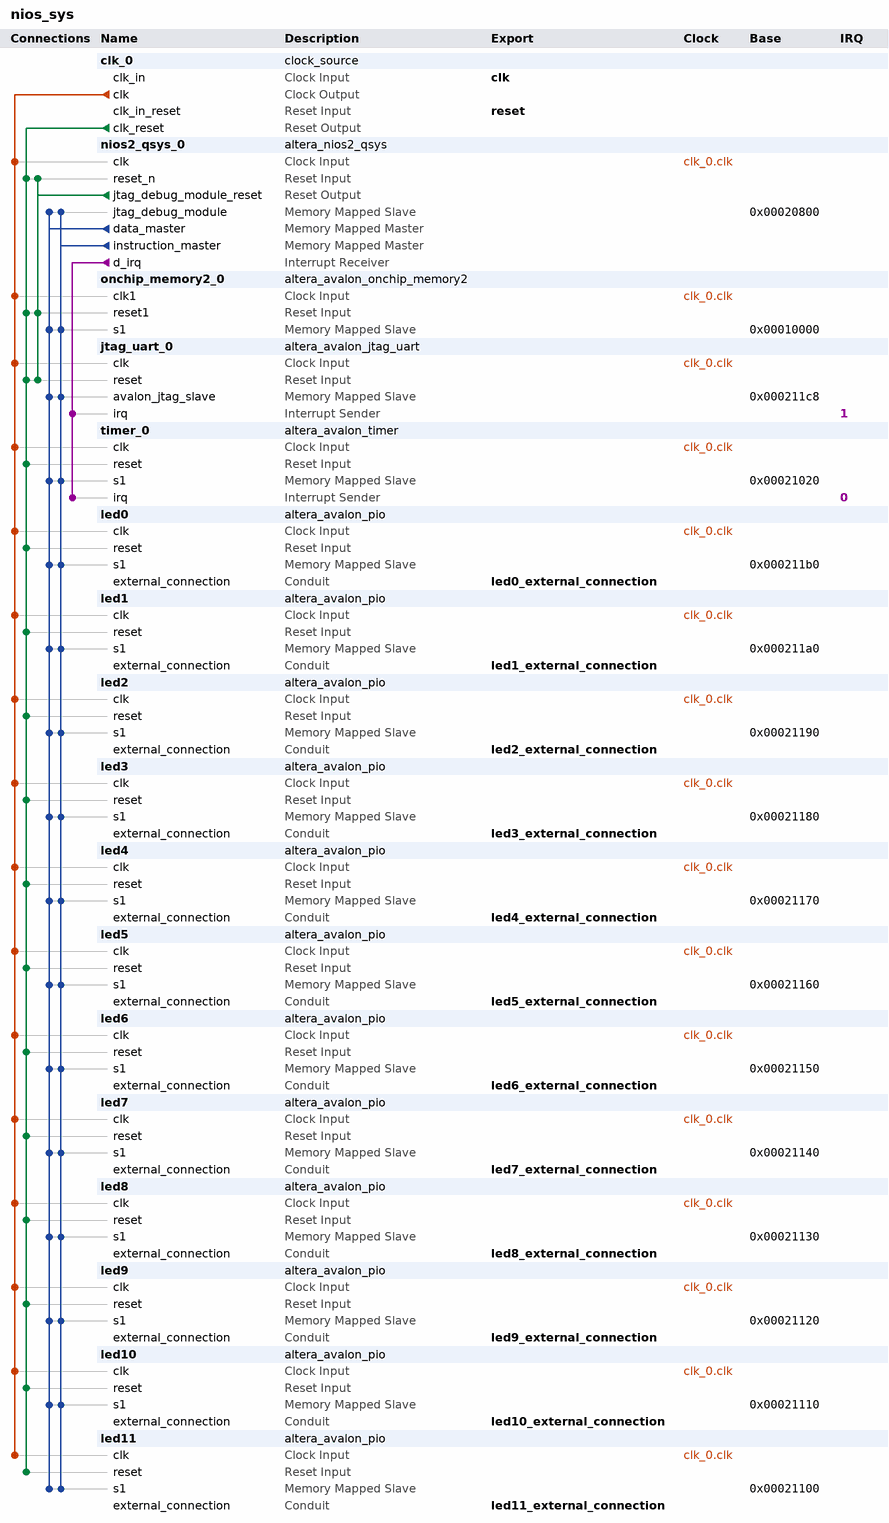
[diagram p0: system contents]
# Platform Designer (Qsys) system nios_sys, Cyclone IV E EP4CE115F29C8
# Parameters at their usual value, and those the tool derives, are not listed.
package require -exact qsys 13.0.1.99.2
create_system nios_sys
set_project_property DEVICE_FAMILY {Cyclone IV E}
set_project_property DEVICE EP4CE115F29C8

add_instance clk_0 clock_source 13.0
set_instance_parameter_value clk_0 clockFrequency 50000000

add_instance nios2_qsys_0 altera_nios2_qsys 13.0
set_instance_parameter_value nios2_qsys_0 resetSlave onchip_memory2_0.s1
set_instance_parameter_value nios2_qsys_0 mmu_TLBMissExcSlave None
set_instance_parameter_value nios2_qsys_0 exceptionSlave onchip_memory2_0.s1
set_instance_parameter_value nios2_qsys_0 breakSlave nios2_qsys_0.jtag_debug_module
set_instance_parameter_value nios2_qsys_0 impl Small
set_instance_parameter_value nios2_qsys_0 icache_size 4096

add_instance onchip_memory2_0 altera_avalon_onchip_memory2 13.0.1.99.2
set_instance_parameter_value onchip_memory2_0 dataWidth 32
set_instance_parameter_value onchip_memory2_0 dualPort false
set_instance_parameter_value onchip_memory2_0 initMemContent true
set_instance_parameter_value onchip_memory2_0 initializationFileName onchip_mem.hex
set_instance_parameter_value onchip_memory2_0 memorySize 40000

add_instance jtag_uart_0 altera_avalon_jtag_uart 13.0.1.99.2
set_instance_parameter_value jtag_uart_0 simInteractiveOptions NO_INTERACTIVE_WINDOWS

add_instance timer_0 altera_avalon_timer 13.0.1.99.2
set_instance_parameter_value timer_0 period 1
set_instance_parameter_value timer_0 periodUnits MSEC

add_instance led0 altera_avalon_pio 13.0.1.99.2
set_instance_parameter_value led0 direction Output
set_instance_parameter_value led0 width 8

add_instance led1 altera_avalon_pio 13.0.1.99.2
set_instance_parameter_value led1 direction Output
set_instance_parameter_value led1 width 8

add_instance led2 altera_avalon_pio 13.0.1.99.2
set_instance_parameter_value led2 direction Output
set_instance_parameter_value led2 width 8

add_instance led3 altera_avalon_pio 13.0.1.99.2
set_instance_parameter_value led3 direction Output
set_instance_parameter_value led3 width 8

add_instance led4 altera_avalon_pio 13.0.1.99.2
set_instance_parameter_value led4 direction Output
set_instance_parameter_value led4 width 8

add_instance led5 altera_avalon_pio 13.0.1.99.2
set_instance_parameter_value led5 direction Output
set_instance_parameter_value led5 width 8

add_instance led6 altera_avalon_pio 13.0.1.99.2
set_instance_parameter_value led6 direction Output
set_instance_parameter_value led6 width 8

add_instance led7 altera_avalon_pio 13.0.1.99.2
set_instance_parameter_value led7 direction Output
set_instance_parameter_value led7 width 8

add_instance led8 altera_avalon_pio 13.0.1.99.2
set_instance_parameter_value led8 direction Output
set_instance_parameter_value led8 width 8

add_instance led9 altera_avalon_pio 13.0.1.99.2
set_instance_parameter_value led9 direction Output
set_instance_parameter_value led9 width 8

add_instance led10 altera_avalon_pio 13.0.1.99.2
set_instance_parameter_value led10 direction Output
set_instance_parameter_value led10 width 8

add_instance led11 altera_avalon_pio 13.0.1.99.2
set_instance_parameter_value led11 direction Output
set_instance_parameter_value led11 width 8

# connections
add_connection clk_0.clk jtag_uart_0.clk clock
add_connection clk_0.clk led0.clk clock
add_connection clk_0.clk led1.clk clock
add_connection clk_0.clk led2.clk clock
add_connection clk_0.clk led3.clk clock
add_connection clk_0.clk led4.clk clock
add_connection clk_0.clk led5.clk clock
add_connection clk_0.clk led6.clk clock
add_connection clk_0.clk led7.clk clock
add_connection clk_0.clk led8.clk clock
add_connection clk_0.clk led9.clk clock
add_connection clk_0.clk led10.clk clock
add_connection clk_0.clk led11.clk clock
add_connection clk_0.clk nios2_qsys_0.clk clock
add_connection clk_0.clk onchip_memory2_0.clk1 clock
add_connection clk_0.clk timer_0.clk clock
add_connection clk_0.clk_reset jtag_uart_0.reset reset
add_connection clk_0.clk_reset led0.reset reset
add_connection clk_0.clk_reset led1.reset reset
add_connection clk_0.clk_reset led2.reset reset
add_connection clk_0.clk_reset led3.reset reset
add_connection clk_0.clk_reset led4.reset reset
add_connection clk_0.clk_reset led5.reset reset
add_connection clk_0.clk_reset led6.reset reset
add_connection clk_0.clk_reset led7.reset reset
add_connection clk_0.clk_reset led8.reset reset
add_connection clk_0.clk_reset led9.reset reset
add_connection clk_0.clk_reset led10.reset reset
add_connection clk_0.clk_reset led11.reset reset
add_connection clk_0.clk_reset nios2_qsys_0.reset_n reset
add_connection clk_0.clk_reset onchip_memory2_0.reset1 reset
add_connection clk_0.clk_reset timer_0.reset reset
add_connection nios2_qsys_0.jtag_debug_module_reset jtag_uart_0.reset reset
add_connection nios2_qsys_0.jtag_debug_module_reset nios2_qsys_0.reset_n reset
add_connection nios2_qsys_0.jtag_debug_module_reset onchip_memory2_0.reset1 reset
add_connection nios2_qsys_0.data_master jtag_uart_0.avalon_jtag_slave avalon
set_connection_parameter_value nios2_qsys_0.data_master/jtag_uart_0.avalon_jtag_slave baseAddress 0x000211c8
add_connection nios2_qsys_0.data_master led0.s1 avalon
set_connection_parameter_value nios2_qsys_0.data_master/led0.s1 baseAddress 0x000211b0
add_connection nios2_qsys_0.data_master led1.s1 avalon
set_connection_parameter_value nios2_qsys_0.data_master/led1.s1 baseAddress 0x000211a0
add_connection nios2_qsys_0.data_master led2.s1 avalon
set_connection_parameter_value nios2_qsys_0.data_master/led2.s1 baseAddress 0x00021190
add_connection nios2_qsys_0.data_master led3.s1 avalon
set_connection_parameter_value nios2_qsys_0.data_master/led3.s1 baseAddress 0x00021180
add_connection nios2_qsys_0.data_master led4.s1 avalon
set_connection_parameter_value nios2_qsys_0.data_master/led4.s1 baseAddress 0x00021170
add_connection nios2_qsys_0.data_master led5.s1 avalon
set_connection_parameter_value nios2_qsys_0.data_master/led5.s1 baseAddress 0x00021160
add_connection nios2_qsys_0.data_master led6.s1 avalon
set_connection_parameter_value nios2_qsys_0.data_master/led6.s1 baseAddress 0x00021150
add_connection nios2_qsys_0.data_master led7.s1 avalon
set_connection_parameter_value nios2_qsys_0.data_master/led7.s1 baseAddress 0x00021140
add_connection nios2_qsys_0.data_master led8.s1 avalon
set_connection_parameter_value nios2_qsys_0.data_master/led8.s1 baseAddress 0x00021130
add_connection nios2_qsys_0.data_master led9.s1 avalon
set_connection_parameter_value nios2_qsys_0.data_master/led9.s1 baseAddress 0x00021120
add_connection nios2_qsys_0.data_master led10.s1 avalon
set_connection_parameter_value nios2_qsys_0.data_master/led10.s1 baseAddress 0x00021110
add_connection nios2_qsys_0.data_master led11.s1 avalon
set_connection_parameter_value nios2_qsys_0.data_master/led11.s1 baseAddress 0x00021100
add_connection nios2_qsys_0.data_master nios2_qsys_0.jtag_debug_module avalon
set_connection_parameter_value nios2_qsys_0.data_master/nios2_qsys_0.jtag_debug_module baseAddress 0x00020800
add_connection nios2_qsys_0.data_master onchip_memory2_0.s1 avalon
set_connection_parameter_value nios2_qsys_0.data_master/onchip_memory2_0.s1 baseAddress 0x00010000
add_connection nios2_qsys_0.data_master timer_0.s1 avalon
set_connection_parameter_value nios2_qsys_0.data_master/timer_0.s1 baseAddress 0x00021020
add_connection nios2_qsys_0.instruction_master jtag_uart_0.avalon_jtag_slave avalon
set_connection_parameter_value nios2_qsys_0.instruction_master/jtag_uart_0.avalon_jtag_slave baseAddress 0x000211c8
add_connection nios2_qsys_0.instruction_master led0.s1 avalon
set_connection_parameter_value nios2_qsys_0.instruction_master/led0.s1 baseAddress 0x000211b0
add_connection nios2_qsys_0.instruction_master led1.s1 avalon
set_connection_parameter_value nios2_qsys_0.instruction_master/led1.s1 baseAddress 0x000211a0
add_connection nios2_qsys_0.instruction_master led2.s1 avalon
set_connection_parameter_value nios2_qsys_0.instruction_master/led2.s1 baseAddress 0x00021190
add_connection nios2_qsys_0.instruction_master led3.s1 avalon
set_connection_parameter_value nios2_qsys_0.instruction_master/led3.s1 baseAddress 0x00021180
add_connection nios2_qsys_0.instruction_master led4.s1 avalon
set_connection_parameter_value nios2_qsys_0.instruction_master/led4.s1 baseAddress 0x00021170
add_connection nios2_qsys_0.instruction_master led5.s1 avalon
set_connection_parameter_value nios2_qsys_0.instruction_master/led5.s1 baseAddress 0x00021160
add_connection nios2_qsys_0.instruction_master led6.s1 avalon
set_connection_parameter_value nios2_qsys_0.instruction_master/led6.s1 baseAddress 0x00021150
add_connection nios2_qsys_0.instruction_master led7.s1 avalon
set_connection_parameter_value nios2_qsys_0.instruction_master/led7.s1 baseAddress 0x00021140
add_connection nios2_qsys_0.instruction_master led8.s1 avalon
set_connection_parameter_value nios2_qsys_0.instruction_master/led8.s1 baseAddress 0x00021130
add_connection nios2_qsys_0.instruction_master led9.s1 avalon
set_connection_parameter_value nios2_qsys_0.instruction_master/led9.s1 baseAddress 0x00021120
add_connection nios2_qsys_0.instruction_master led10.s1 avalon
set_connection_parameter_value nios2_qsys_0.instruction_master/led10.s1 baseAddress 0x00021110
add_connection nios2_qsys_0.instruction_master led11.s1 avalon
set_connection_parameter_value nios2_qsys_0.instruction_master/led11.s1 baseAddress 0x00021100
add_connection nios2_qsys_0.instruction_master nios2_qsys_0.jtag_debug_module avalon
set_connection_parameter_value nios2_qsys_0.instruction_master/nios2_qsys_0.jtag_debug_module baseAddress 0x00020800
add_connection nios2_qsys_0.instruction_master onchip_memory2_0.s1 avalon
set_connection_parameter_value nios2_qsys_0.instruction_master/onchip_memory2_0.s1 baseAddress 0x00010000
add_connection nios2_qsys_0.instruction_master timer_0.s1 avalon
set_connection_parameter_value nios2_qsys_0.instruction_master/timer_0.s1 baseAddress 0x00021020
add_connection nios2_qsys_0.d_irq jtag_uart_0.irq interrupt
set_connection_parameter_value nios2_qsys_0.d_irq/jtag_uart_0.irq irqNumber 1
add_connection nios2_qsys_0.d_irq timer_0.irq interrupt
set_connection_parameter_value nios2_qsys_0.d_irq/timer_0.irq irqNumber 0

# exported interfaces
add_interface clk clock sink
set_interface_property clk EXPORT_OF clk_0.clk_in
add_interface reset reset sink
set_interface_property reset EXPORT_OF clk_0.clk_in_reset
add_interface led11_external_connection conduit end
set_interface_property led11_external_connection EXPORT_OF led11.external_connection
add_interface led10_external_connection conduit end
set_interface_property led10_external_connection EXPORT_OF led10.external_connection
add_interface led9_external_connection conduit end
set_interface_property led9_external_connection EXPORT_OF led9.external_connection
add_interface led8_external_connection conduit end
set_interface_property led8_external_connection EXPORT_OF led8.external_connection
add_interface led7_external_connection conduit end
set_interface_property led7_external_connection EXPORT_OF led7.external_connection
add_interface led6_external_connection conduit end
set_interface_property led6_external_connection EXPORT_OF led6.external_connection
add_interface led5_external_connection conduit end
set_interface_property led5_external_connection EXPORT_OF led5.external_connection
add_interface led4_external_connection conduit end
set_interface_property led4_external_connection EXPORT_OF led4.external_connection
add_interface led3_external_connection conduit end
set_interface_property led3_external_connection EXPORT_OF led3.external_connection
add_interface led2_external_connection conduit end
set_interface_property led2_external_connection EXPORT_OF led2.external_connection
add_interface led1_external_connection conduit end
set_interface_property led1_external_connection EXPORT_OF led1.external_connection
add_interface led0_external_connection conduit end
set_interface_property led0_external_connection EXPORT_OF led0.external_connection

set_interconnect_requirement {$system} qsys_mm.clockCrossingAdapter HANDSHAKE
set_interconnect_requirement {$system} qsys_mm.maxAdditionalLatency 1

save_system nios_sys.qsys
